# Altium schematic sheet BDC_BS1.SchDoc
size A4
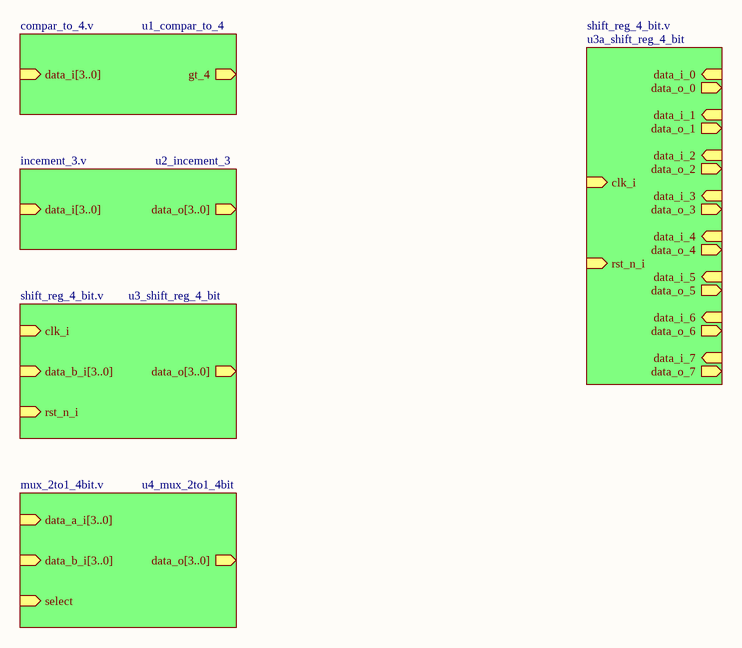
[diagram p0: BDC_BS1.SchDoc]

## Sub-sheets
u1_compar_to_4 = compar_to_4.v: data_i[3..0] (in), gt_4 (out)
u2_incement_3 = incement_3.v: data_i[3..0] (in), data_o[3..0] (out)
u3_shift_reg_4_bit = shift_reg_4_bit.v: clk_i (in), data_b_i[3..0] (in), data_o[3..0] (out), rst_n_i (in)
u3a_shift_reg_4_bit = shift_reg_4_bit.v: data_i_0 (in), clk_i (in), rst_n_i (in), data_o_0 (out), data_i_1 (in), data_i_2 (in), data_i_3 (in), data_i_4 (in), data_i_5 (in), data_i_6 (in), data_i_7 (in), data_o_1 (out), data_o_2 (out), data_o_3 (out), data_o_4 (out), data_o_5 (out), data_o_6 (out), data_o_7 (out)
u4_mux_2to1_4bit = mux_2to1_4bit.v: data_a_i[3..0] (in), data_b_i[3..0] (in), data_o[3..0] (out), select (in)